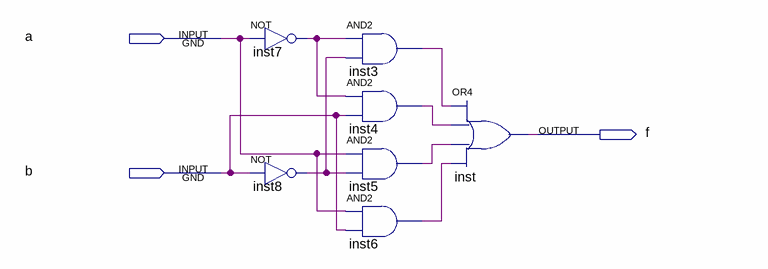
[diagram p0: schematic sheet]
// Quartus schematic 2-1-2-before.bdf as structural Verilog: 7 symbols, 3 pins
module \2-1-2-before  (
  input  a,
  input  b,
  output f
);

  wire inst3_out, inst4_out, inst5_out, inst6_out, inst7_out, inst8_out;

  not inst7 (inst7_out, a);
  not inst8 (inst8_out, b);
  and inst3 (inst3_out, inst7_out, inst8_out);
  and inst4 (inst4_out, inst7_out, b);
  and inst5 (inst5_out, a, inst8_out);
  and inst6 (inst6_out, a, b);
  or inst (f, inst3_out, inst4_out, inst5_out, inst6_out);
endmodule
